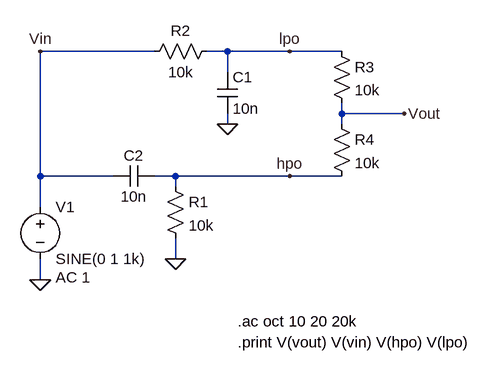
[diagram p0: schematic Draft4.asc]
Draft4.asc, the LTspice schematic file:
Version 4
SHEET 1 912 680
WIRE 272 -128 96 -128
WIRE 384 -128 352 -128
WIRE 480 -128 384 -128
WIRE 560 -128 480 -128
WIRE 384 -96 384 -128
WIRE 560 -32 560 -48
WIRE 656 -32 560 -32
WIRE 384 -16 384 -32
WIRE 560 -16 560 -32
WIRE 96 64 96 -128
WIRE 208 64 96 64
WIRE 304 64 272 64
WIRE 480 64 304 64
WIRE 560 64 480 64
WIRE 304 80 304 64
WIRE 96 112 96 64
WIRE 304 192 304 160
WIRE 96 224 96 192
FLAG 384 -16 0
FLAG 304 192 0
FLAG 96 224 0
FLAG 656 -32 Vout
FLAG 96 -128 Vin
FLAG 480 -128 lpo
FLAG 480 64 hpo
SYMBOL voltage 96 96 R0
WINDOW 123 24 124 Left 2
WINDOW 39 0 0 Left 2
SYMATTR InstName V1
SYMATTR Value SINE(0 1 1k)
SYMATTR Value2 AC 1
SYMBOL res 288 64 R0
SYMATTR InstName R1
SYMATTR Value 10k
SYMBOL res 368 -144 R90
WINDOW 0 0 56 VBottom 2
WINDOW 3 32 56 VTop 2
SYMATTR InstName R2
SYMATTR Value 10k
SYMBOL cap 368 -96 R0
SYMATTR InstName C1
SYMATTR Value 10n
SYMBOL cap 272 48 R90
WINDOW 0 0 32 VBottom 2
WINDOW 3 32 32 VTop 2
SYMATTR InstName C2
SYMATTR Value 10n
SYMBOL res 544 -144 R0
SYMATTR InstName R3
SYMATTR Value 10k
SYMBOL res 544 -32 R0
SYMATTR InstName R4
SYMATTR Value 10k
TEXT 400 288 Left 2 !.ac oct 10 20 20k
TEXT 400 320 Left 2 !.print V(vout) V(vin) V(hpo) V(lpo)

The netlist it stands for:
* Draft4.asc
V1 Vin 0 SINE(0 1 1k) AC 1
R1 hpo 0 10k
R2 lpo Vin 10k
C1 lpo 0 10n
C2 hpo Vin 10n
R3 lpo Vout 10k
R4 Vout hpo 10k
.ac oct 10 20 20k
.print V(vout) V(vin) V(hpo) V(lpo)
.backanno
.end